# EAGLE schematic Board_1 (EAGLE 9.1.0)
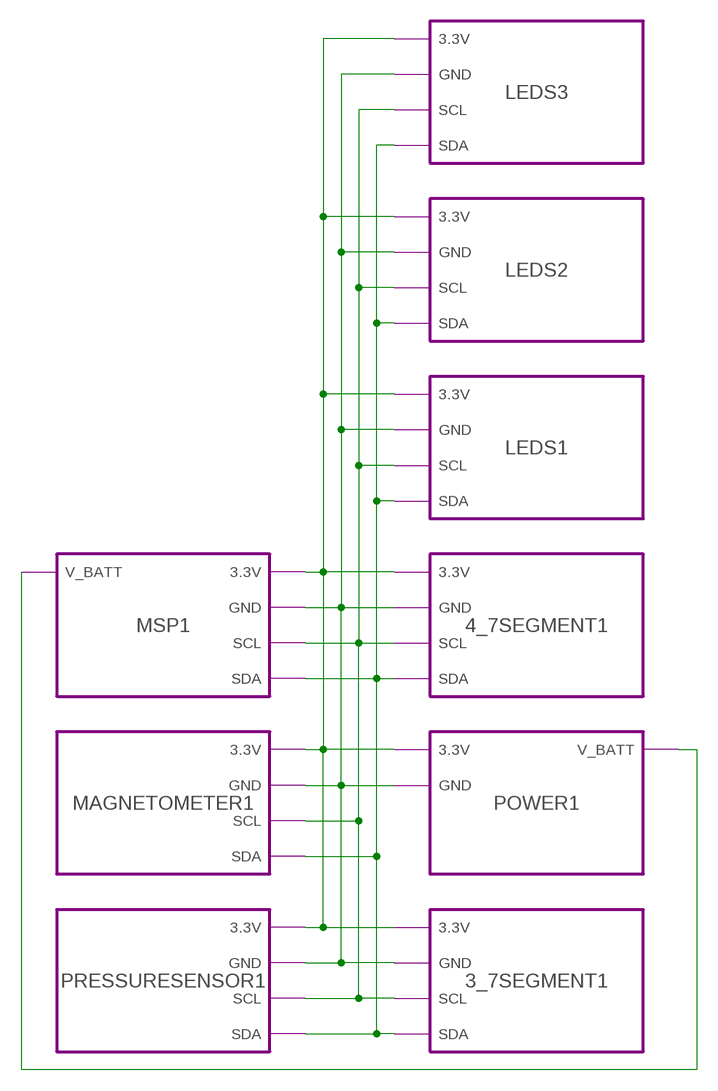
[diagram p0: schematic, sheet 1]

## Module instances
3_7SEGMENT1 = 3_7SEGMENT
4_7SEGMENT1 = 4_7SEGMENT
MAGNETOMETER1 = MAGNETOMETER
POWER1 = POWER
PRESSURESENSOR1 = PRESSURESENSOR
MSP1 = MSP
LEDS1 = LEDS
LEDS2 = LEDS
LEDS3 = LEDS

## Nets
3.3V: port MAGNETOMETER1.3.3V PRESSURESENSOR1.3.3V POWER1.3.3V MSP1.3.3V LEDS3.3.3V 3_7SEGMENT1.3.3V LEDS2.3.3V LEDS1.3.3V 4_7SEGMENT1.3.3V
GND: port MAGNETOMETER1.GND POWER1.GND PRESSURESENSOR1.GND 4_7SEGMENT1.GND 3_7SEGMENT1.GND MSP1.GND LEDS3.GND LEDS2.GND LEDS1.GND
N$1: port POWER1.V_BATT MSP1.V_BATT
SCL: port PRESSURESENSOR1.SCL 4_7SEGMENT1.SCL MAGNETOMETER1.SCL 3_7SEGMENT1.SCL MSP1.SCL LEDS3.SCL LEDS2.SCL LEDS1.SCL
SDA: port PRESSURESENSOR1.SDA 4_7SEGMENT1.SDA MAGNETOMETER1.SDA 3_7SEGMENT1.SDA MSP1.SDA LEDS3.SDA LEDS2.SDA LEDS1.SDA

## Library data of the parts

## Module MAGNETOMETER
Ports: 3.3V(io) GND(io) SCL(io) SDA(io)
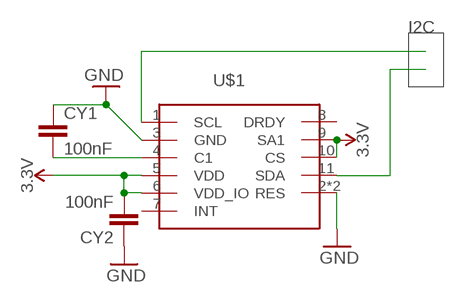
[diagram p1: schematic, module MAGNETOMETER, sheet 1]

### Parts
CY1  100nF  CYYC7B5  [YC7B5]
CY2  100nF  CYYC7B5  [YC7B5]
U$1  LIS3MDLTR  [LGA-12]

### Nets
3.3V: CY2.2 U$1.5(VDD) U$1.6(VDD_IO) U$1.9(SA1) U$1.10(CS)
GND: CY1.1 CY2.1 U$1.2(RES) U$1.3(GND) U$1.12(RES)
N$3: CY1.2 U$1.4(C1)
SCL: U$1.1(SCL)
SDA: U$1.11(SDA)
Unconnected: U$1.7(INT) U$1.8(DRDY)

### Notes on the sheet
- I2C

### Library data of the parts
CY1 CY2 = rcl:CY: Y CAPACITOR for power line; SPICEPREFIX: C
U$1 = LED Driver:LIS3MDLTR

## Module POWER
Ports: GND(io) 3.3V(io) V_BATT(io)
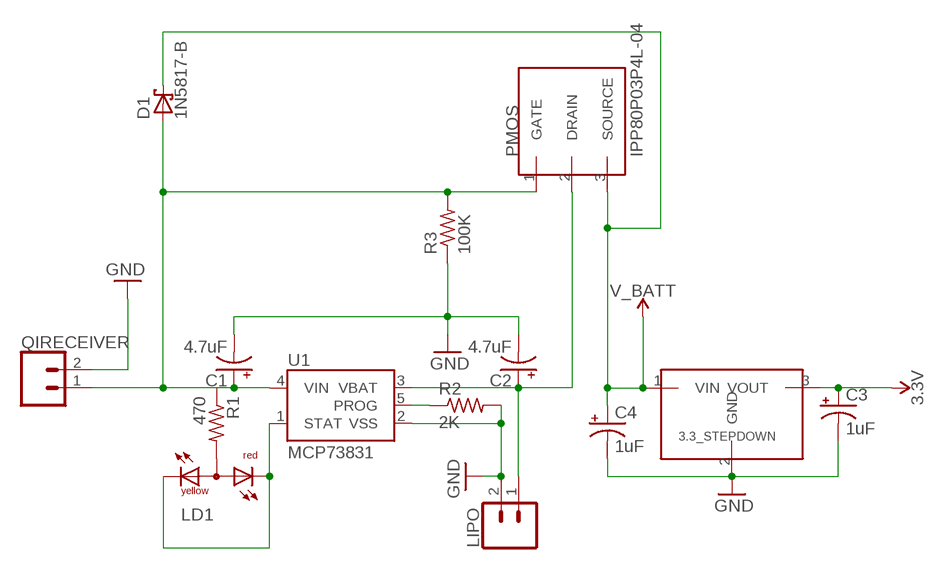
[diagram p2: schematic, module POWER, sheet 1]

### Parts
3.3_STEPDOWN  MCP1826S  [T03B]
C1  4.7uF  1000UF-RADIAL-5MM-25V-20%  [CPOL-RADIAL-5MM-10MM]
C2  4.7uF  1000UF-RADIAL-5MM-25V-20%  [CPOL-RADIAL-5MM-10MM]
C3  1uF  1000UF-RADIAL-5MM-25V-20%  [CPOL-RADIAL-5MM-10MM]
C4  1uF  1000UF-RADIAL-5MM-25V-20%  [CPOL-RADIAL-5MM-10MM]
D1  1N5817-B  [DO41-7.6]
LD1  DUOLED-RY-A  [DUOLED-A-5MM]
LIPO  CONN_02  [1X02]
PMOS  IPP80P03P4L-04  [T03B]
QIRECEIVER  CONN_02  [1X02]
R1  470  R-US_VMTA55  [VMTA55]
R2  2K  R-US_VMTA55  [VMTA55]
R3  100K  R-US_VMTA55  [VMTA55]
U1  MCP73831  [SOT23-5]

### Nets
3.3V: 3.3_STEPDOWN.3(VOUT) C3.+
GND: 3.3_STEPDOWN.2(GND) C1.- C2.- C3.- C4.- LIPO.2 QIRECEIVER.2 R2.2 R3.1 U1.2(VSS)
N$2: C2.+ LIPO.1 PMOS.2(DRAIN) U1.3(VBAT)
N$3: LD1.CR LD1.CX(CY) U1.1(STAT)
N$4: C1.+ D1.A PMOS.1(GATE) QIRECEIVER.1 R1.1 R3.2 U1.4(VIN)
N$6: R2.1 U1.5(PROG)
N$7: LD1.A R1.2
V_BATT: 3.3_STEPDOWN.1(VIN) C4.+ D1.C PMOS.3(SOURCE)

### Library data of the parts
3.3_STEPDOWN = LED Driver:MCP1826S
C1-C4 = SparkFun-Capacitors:1000UF: 1,000µF/1mF ceramic capacitors A capacitor is a passive two-terminal electrical component used to store electrical energy temporarily in an electric field. CAP-08070; PROD_ID: CAP-09538; VALUE: 1mF
D1 = diode:1N581*: 1.0A SCHOTTKY BARRIER RECTIFIER Source: http://www.diodes.com/datasheets/ds23001.pdf
LD1 = led:DUOLED-RY-A: DUO LED 2 colors (red/yellow), 5 mm, round, common Anode www.ligitek.com or other producers.
LIPO QIRECEIVER = SparkFun-Connectors:CONN_02: Multi connection point. Often used as Generic Header-pin footprint for 0.1 inch spaced/style header connections On any of the 0.1 inch spaced packages, you can populate with these: Break Away Headers - Straight <https://www.sparkfun.com/products/116> (PRT-00116) Break Away Male Headers - Right Angle <https://www.sparkfun.com/products/553> (PRT-00553) Female Headers <https://www.sparkfun.com/products/115> (PRT-00115) Break Away Headers - Machine Pin <https://www.sparkfun.com/products/117> (PRT-00117) Break Away Female Headers - Swiss Machine Pin <https://www.sparkfun.com/products/743> (PRT-00743) For SCREWTERMINALS and SPRING TERMINALS visit here: Screw Terimnals on SparkFun.com <https://www.sparkfun.com/search/results?term=Screw+Terminals> (5mm/3.5mm/2.54mm spacing) This device is also useful as a general connection point to wire up your design to another part of your project. Our various solder wires solder well into these plated through hole pads. Hook-Up Wire - Assortment (Stranded, 22 AWG) <https://www.sparkfun.com/products/11375> (PRT-11375) Hook-Up Wire - Assortment (Solid Core, 22 AWG) <https://www.sparkfun.com/products/11367> (PRT-11367) View the entire wire category on our website here <https://www.sparkfun.com/categories/141> Special notes: Molex polarized connector foot print use with: PRT-08233 with associated crimp pins and housings. 2.54_SCREWTERM for use with PRT-10571. 3.5mm Screw Terminal footprints for PRT-08084 5mm Screw Terminal footprints for use with PRT-08432
PMOS = LED Driver:IPP80P03P4L-04
R1-R3 = rcl:R-US_: RESISTOR, American symbol
U1 = SparkFun-IC-Power:MCP73831: MCP73831T Li-Ion, Li-Pol Controller Miniature single cell, fully integrated Li-Ion, Li-polymer charge management controller Datasheet <http://ww1.microchip.com/downloads/en/DeviceDoc/20001984g.pdf> SparkFun Products: SparkFun ESP32 Thing <https://www.sparkfun.com/products/13907> SparkFun 9DoF Razor IMU M0 <https://www.sparkfun.com/products/14001>; PROD_ID: IC-09995

## Module 4_7SEGMENT
Ports: GND(io) SCL(io) SDA(io) 3.3V(io)
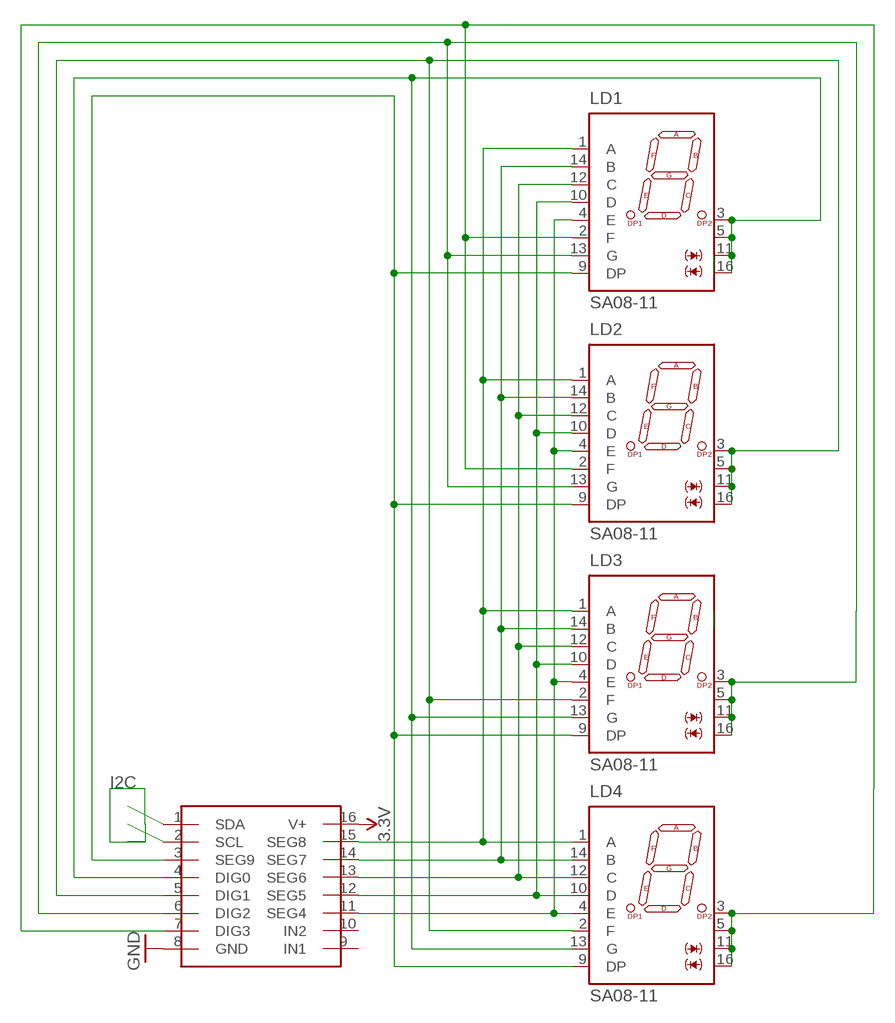
[diagram p3: schematic, module 4_7SEGMENT, sheet 1]

### Parts
LD1  SA08-11  [SA08]
LD2  SA08-11  [SA08]
LD3  SA08-11  [SA08]
LD4  SA08-11  [SA08]
LED_DRIVER_1  MAX6958BAPE+  [DIP16]

### Nets
3.3V: LED_DRIVER_1.16(V+)
GND: LED_DRIVER_1.8(GND)
N$1: LD1.1(A) LD2.1(A) LD3.1(A) LD4.1(A) LED_DRIVER_1.15(SEG8)
N$2: LD1.14(B) LD2.14(B) LD3.14(B) LD4.14(B) LED_DRIVER_1.14(SEG7)
N$3: LD1.12(C) LD2.12(C) LD3.12(C) LD4.12(C) LED_DRIVER_1.13(SEG6)
N$4: LD1.10(D) LD2.10(D) LD3.10(D) LD4.10(D) LED_DRIVER_1.12(SEG5)
N$5: LD1.4(E) LD2.4(E) LD3.4(E) LD4.4(E) LED_DRIVER_1.11(SEG4)
N$6: LD1.3(AK) LD1.5(AK) LD1.11(AK) LD1.16(AK) LD3.13(G) LD4.13(G) LED_DRIVER_1.4(DIG0)
N$7: LD1.9(DP) LD2.9(DP) LD3.9(DP) LD4.9(DP) LED_DRIVER_1.3(SEG9)
N$9: LD1.2(F) LD2.2(F) LD4.3(AK) LD4.5(AK) LD4.11(AK) LD4.16(AK) LED_DRIVER_1.7(DIG3)
N$12: LD2.3(AK) LD2.5(AK) LD2.11(AK) LD2.16(AK) LD3.2(F) LD4.2(F) LED_DRIVER_1.5(DIG1)
N$13: LD1.13(G) LD2.13(G) LD3.3(AK) LD3.5(AK) LD3.11(AK) LD3.16(AK) LED_DRIVER_1.6(DIG2)
SCL: LED_DRIVER_1.2(SCL)
SDA: LED_DRIVER_1.1(SDA)
Unconnected: LED_DRIVER_1.9(IN1) LED_DRIVER_1.10(IN2)

### Library data of the parts
LD1-LD4 = led:S*08: Kingbright 20mm (0.8Inch) Single Digit Numeric Display Source: SA08-11SRWA.pdf
LED_DRIVER_1 = UnderwaterSensorProject2:MAX6958BAPE+

## Module 3_7SEGMENT
Ports: GND(io) SCL(io) SDA(io) 3.3V(io)
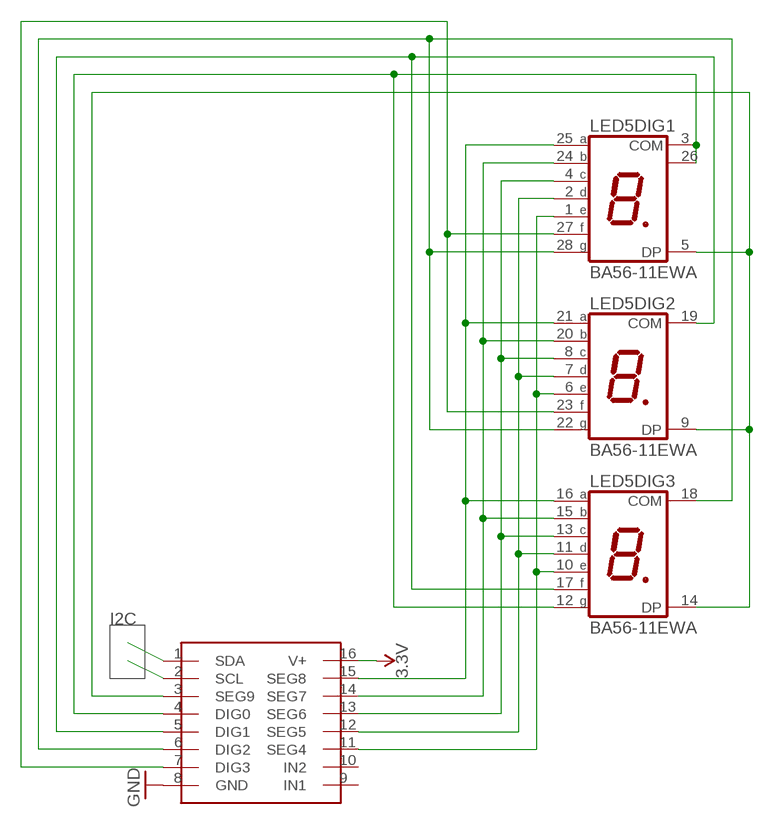
[diagram p4: schematic, module 3_7SEGMENT, sheet 1]

### Parts
LED5  BA56-11EWA  [BA/BC56]
U$1  MAX6958BAPE+  [DIP16]

### Nets
3.3V: U$1.16(V+)
GND: U$1.8(GND)
N$1: LED5.3(DIG1:COM) LED5.12(DIG3:G) LED5.26(DIG1:COM) U$1.4(DIG0)
N$2: LED5.5(DIG1:DP) LED5.9(DIG2:DP) LED5.14(DIG3:DP) U$1.3(SEG9)
N$8: LED5.16(DIG3:A) LED5.21(DIG2:A) LED5.25(DIG1:A) U$1.15(SEG8)
N$9: LED5.15(DIG3:B) LED5.20(DIG2:B) LED5.24(DIG1:B) U$1.14(SEG7)
N$10: LED5.4(DIG1:C) LED5.8(DIG2:C) LED5.13(DIG3:C) U$1.13(SEG6)
N$11: LED5.2(DIG1:D) LED5.7(DIG2:D) LED5.11(DIG3:D) U$1.12(SEG5)
N$26: LED5.1(DIG1:E) LED5.6(DIG2:E) LED5.10(DIG3:E) U$1.11(SEG4)
N$28: LED5.17(DIG3:F) LED5.19(DIG2:COM) U$1.5(DIG1)
N$29: LED5.23(DIG2:F) LED5.27(DIG1:F) U$1.7(DIG3)
N$30: LED5.18(DIG3:COM) LED5.22(DIG2:G) LED5.28(DIG1:G) U$1.6(DIG2)
SCL: U$1.2(SCL)
SDA: U$1.1(SDA)
Unconnected: U$1.9(IN1) U$1.10(IN2)

### Notes on the sheet
- I2C

### Library data of the parts
LED5 = display-kingbright:B?56-11*WA: 14.22mm (0.56INCH) THREE DIGIT NUMERIC DISPLAY Source: http://www.kingbright.com .. BA56-11EWA(Ver1189474895.pdf; OC_FARNELL: unknown; OC_NEWARK: unknown
U$1 = LED Driver:MAX6958BAPE+

## Module PRESSURESENSOR
Ports: 3.3V(io) GND(io) SCL(io) SDA(io)
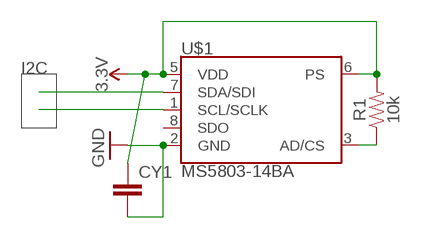
[diagram p5: schematic, module PRESSURESENSOR, sheet 1]

### Parts
CY1  CYYC7B5  [YC7B5]
R1  10k  10KOHM-HORIZ-1/4W-5%  [AXIAL-0.3]
U$1  MS5803-14BA  [DIL8]

### Nets
3.3V: CY1.1 R1.P$2 U$1.5(VDD) U$1.6(PS)
GND: CY1.2 U$1.2(GND)
N$1: R1.P$1 U$1.3(AD/CS)
SCL: U$1.1(SCL/SCLK)
SDA: U$1.7(SDA/SDI)
Unconnected: U$1.8(SDO)

### Notes on the sheet
- I2C

### Library data of the parts
CY1 = rcl:CY: Y CAPACITOR for power line; SPICEPREFIX: C
R1 = SparkFun-Resistors:10KOHM: 10kΩ resistor A resistor is a passive two-terminal electrical component that implements electrical resistance as a circuit element. Resistors act to reduce current flow, and, at the same time, act to lower voltage levels within circuits. - Wikipedia; PROD_ID: RES-09435
U$1 = UnderwaterSensorProject:MS5803-14BA

## Module MSP
Ports: SDA(io) SCL(io) GND(io) 3.3V(io) V_BATT(io)
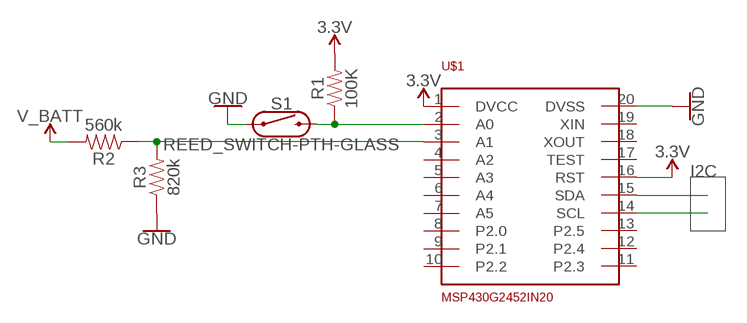
[diagram p6: schematic, module MSP, sheet 1]

### Parts
R1  100K  100OHM-HORIZ-1/4W-1%  [AXIAL-0.3]
R2  560k  100KOHM-HORIZ-1/4W-1%  [AXIAL-0.3]
R3  820k  100KOHM-HORIZ-1/4W-1%  [AXIAL-0.3]
S1  REED_SWITCH-PTH-GLASS  [REED_SWITCH_GLASS]
U$1  MSP430G2452IN20  [DIL20]

### Nets
3.3V: R1.P$2 U$1.1(DVCC) U$1.16(RST)
GND: R3.P$1 S1.P$1 U$1.20(DVSS)
N$1: R1.P$1 S1.P$2 U$1.2(A0)
N$2: R2.P$1 R3.P$2 U$1.3(A1)
SCL: U$1.14(SCL)
SDA: U$1.15(SDA)
V_BATT: R2.P$2
Unconnected: U$1.4(A2) U$1.5(A3) U$1.6(A4) U$1.7(A5) U$1.8(P2.0) U$1.9(P2.1) U$1.10(P2.2) U$1.11(P2.3) U$1.12(P2.4) U$1.13(P2.5) U$1.17(TEST) U$1.18(XOUT) U$1.19(XIN)

### Notes on the sheet
- I2C

### Library data of the parts
R1 = SparkFun-Resistors:100OHM: 100Ω resistor A resistor is a passive two-terminal electrical component that implements electrical resistance as a circuit element. Resistors act to reduce current flow, and, at the same time, act to lower voltage levels within circuits. - Wikipedia; PROD_ID: RES-12181; VALUE: 100
R2 R3 = SparkFun-Resistors:100KOHM: 100kΩ resistor A resistor is a passive two-terminal electrical component that implements electrical resistance as a circuit element. Resistors act to reduce current flow, and, at the same time, act to lower voltage levels within circuits. - Wikipedia; PROD_ID: RES-12184; VALUE: 100k
S1 = SparkFun-Switches:REED_SWITCH: Reed Switch A reed switch is a magnetically-actuated switch. When the device is exposed to a magnetic field, the two ferrous materials inside the switch pull together and the switch closes. Variant Overview PTH-GLASS Reed Switch <https://www.sparkfun.com/products/8642> (COM-08642) - PTH reed switch w/ glass body (6.0 x 0.9 mm) PTH-INSULATED Reed Switch - Insulated <https://www.sparkfun.com/products/10601> (COM-10601) - PTH reed switch w/ insulated body (15.1 x 4.2 mm); PROD_ID: SWCH-09282; SF_SKU: COM-08642
U$1 = UnderwaterSensorProject:MSP430G2452IN20

## Module LEDS
Ports: SDA(io) SCL(io) GND(io) 3.3V(io)
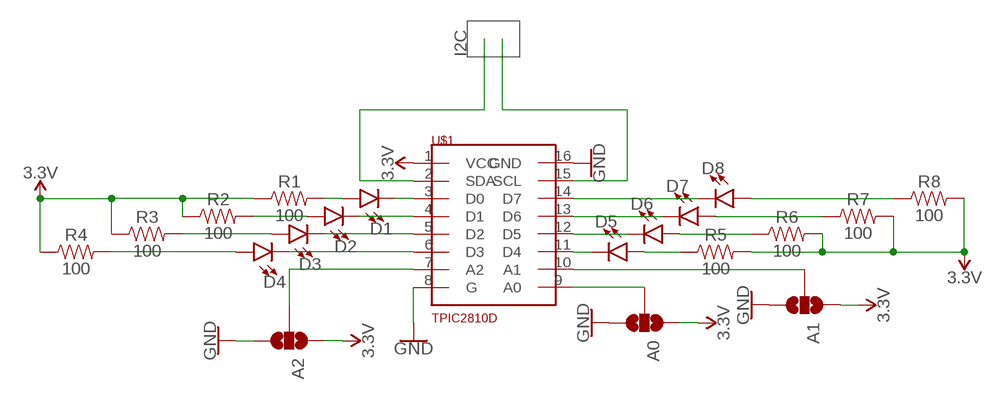
[diagram p7: schematic, module LEDS, sheet 1]

### Parts
A0  JUMPER-SMT_3_NO_SILK  [SMT-JUMPER_3_NO_SILK]
A1  JUMPER-SMT_3_NO_SILK  [SMT-JUMPER_3_NO_SILK]
A2  JUMPER-SMT_3_NO_SILK  [SMT-JUMPER_3_NO_SILK]
D1  LED5MM  [LED_5MM]
D2  LED5MM  [LED_5MM]
D3  LED5MM  [LED_5MM]
D4  LED5MM  [LED_5MM]
D5  LED5MM  [LED_5MM]
D6  LED5MM  [LED_5MM]
D7  LED5MM  [LED_5MM]
D8  LED5MM  [LED_5MM]
R1  100  100OHM-HORIZ-1/4W-1%  [AXIAL-0.3]
R2  100  100OHM-HORIZ-1/4W-1%  [AXIAL-0.3]
R3  100  100OHM-HORIZ-1/4W-1%  [AXIAL-0.3]
R4  100  100OHM-HORIZ-1/4W-1%  [AXIAL-0.3]
R5  100  100OHM-HORIZ-1/4W-1%  [AXIAL-0.3]
R6  100  100OHM-HORIZ-1/4W-1%  [AXIAL-0.3]
R7  100  100OHM-HORIZ-1/4W-1%  [AXIAL-0.3]
R8  100  100OHM-HORIZ-1/4W-1%  [AXIAL-0.3]
U$1  TPIC2810D  [SO16]

### Nets
3.3V: A0.1 A1.1 A2.1 R1.P$1 R2.P$1 R3.P$1 R4.P$1 R5.P$2 R6.P$2 R7.P$2 R8.P$2 U$1.1(VCC)
GND: A0.3 A1.3 A2.3 U$1.8(G) U$1.16(GND)
N$1: D1.K(C) U$1.3(D0)
N$2: D2.K(C) U$1.4(D1)
N$3: D3.K(C) U$1.5(D2)
N$4: D4.K(C) U$1.6(D3)
N$5: D5.K(C) U$1.11(D4)
N$6: D6.K(C) U$1.12(D5)
N$7: D7.K(C) U$1.13(D6)
N$8: D8.K(C) U$1.14(D7)
N$9: A2.2 U$1.7(A2)
N$10: A1.2 U$1.10(A1)
N$11: A0.2 U$1.9(A0)
N$12: D5.A R5.P$1
N$13: D6.A R6.P$1
N$14: D7.A R7.P$1
N$15: D8.A R8.P$1
N$16: D1.A R1.P$2
N$18: D2.A R2.P$2
N$19: D3.A R3.P$2
N$20: D4.A R4.P$2
SCL: U$1.15(SCL)
SDA: U$1.2(SDA)

### Notes on the sheet
- I2C

### Library data of the parts
A0 A1 A2 = SparkFun-Jumpers:JUMPER-SMT_3_NO: Normally open jumper This jumper has three pads in close proximity to each other. Apply solder to close the connection(s).
D1-D8 = SparkFun-LED:LED: LED (Generic) Standard schematic elements and footprints for 5mm, 3mm, 1206, and 0603 sized LEDs. Generic LEDs with no color specified.
R1-R8 = SparkFun-Resistors:100OHM: 100Ω resistor A resistor is a passive two-terminal electrical component that implements electrical resistance as a circuit element. Resistors act to reduce current flow, and, at the same time, act to lower voltage levels within circuits. - Wikipedia; PROD_ID: RES-12181
U$1 = UnderwaterSensorProject:TPIC2810D